# EAGLE schematic ARM-LPC1115_V0.30D_smd (EAGLE 6.5.0)
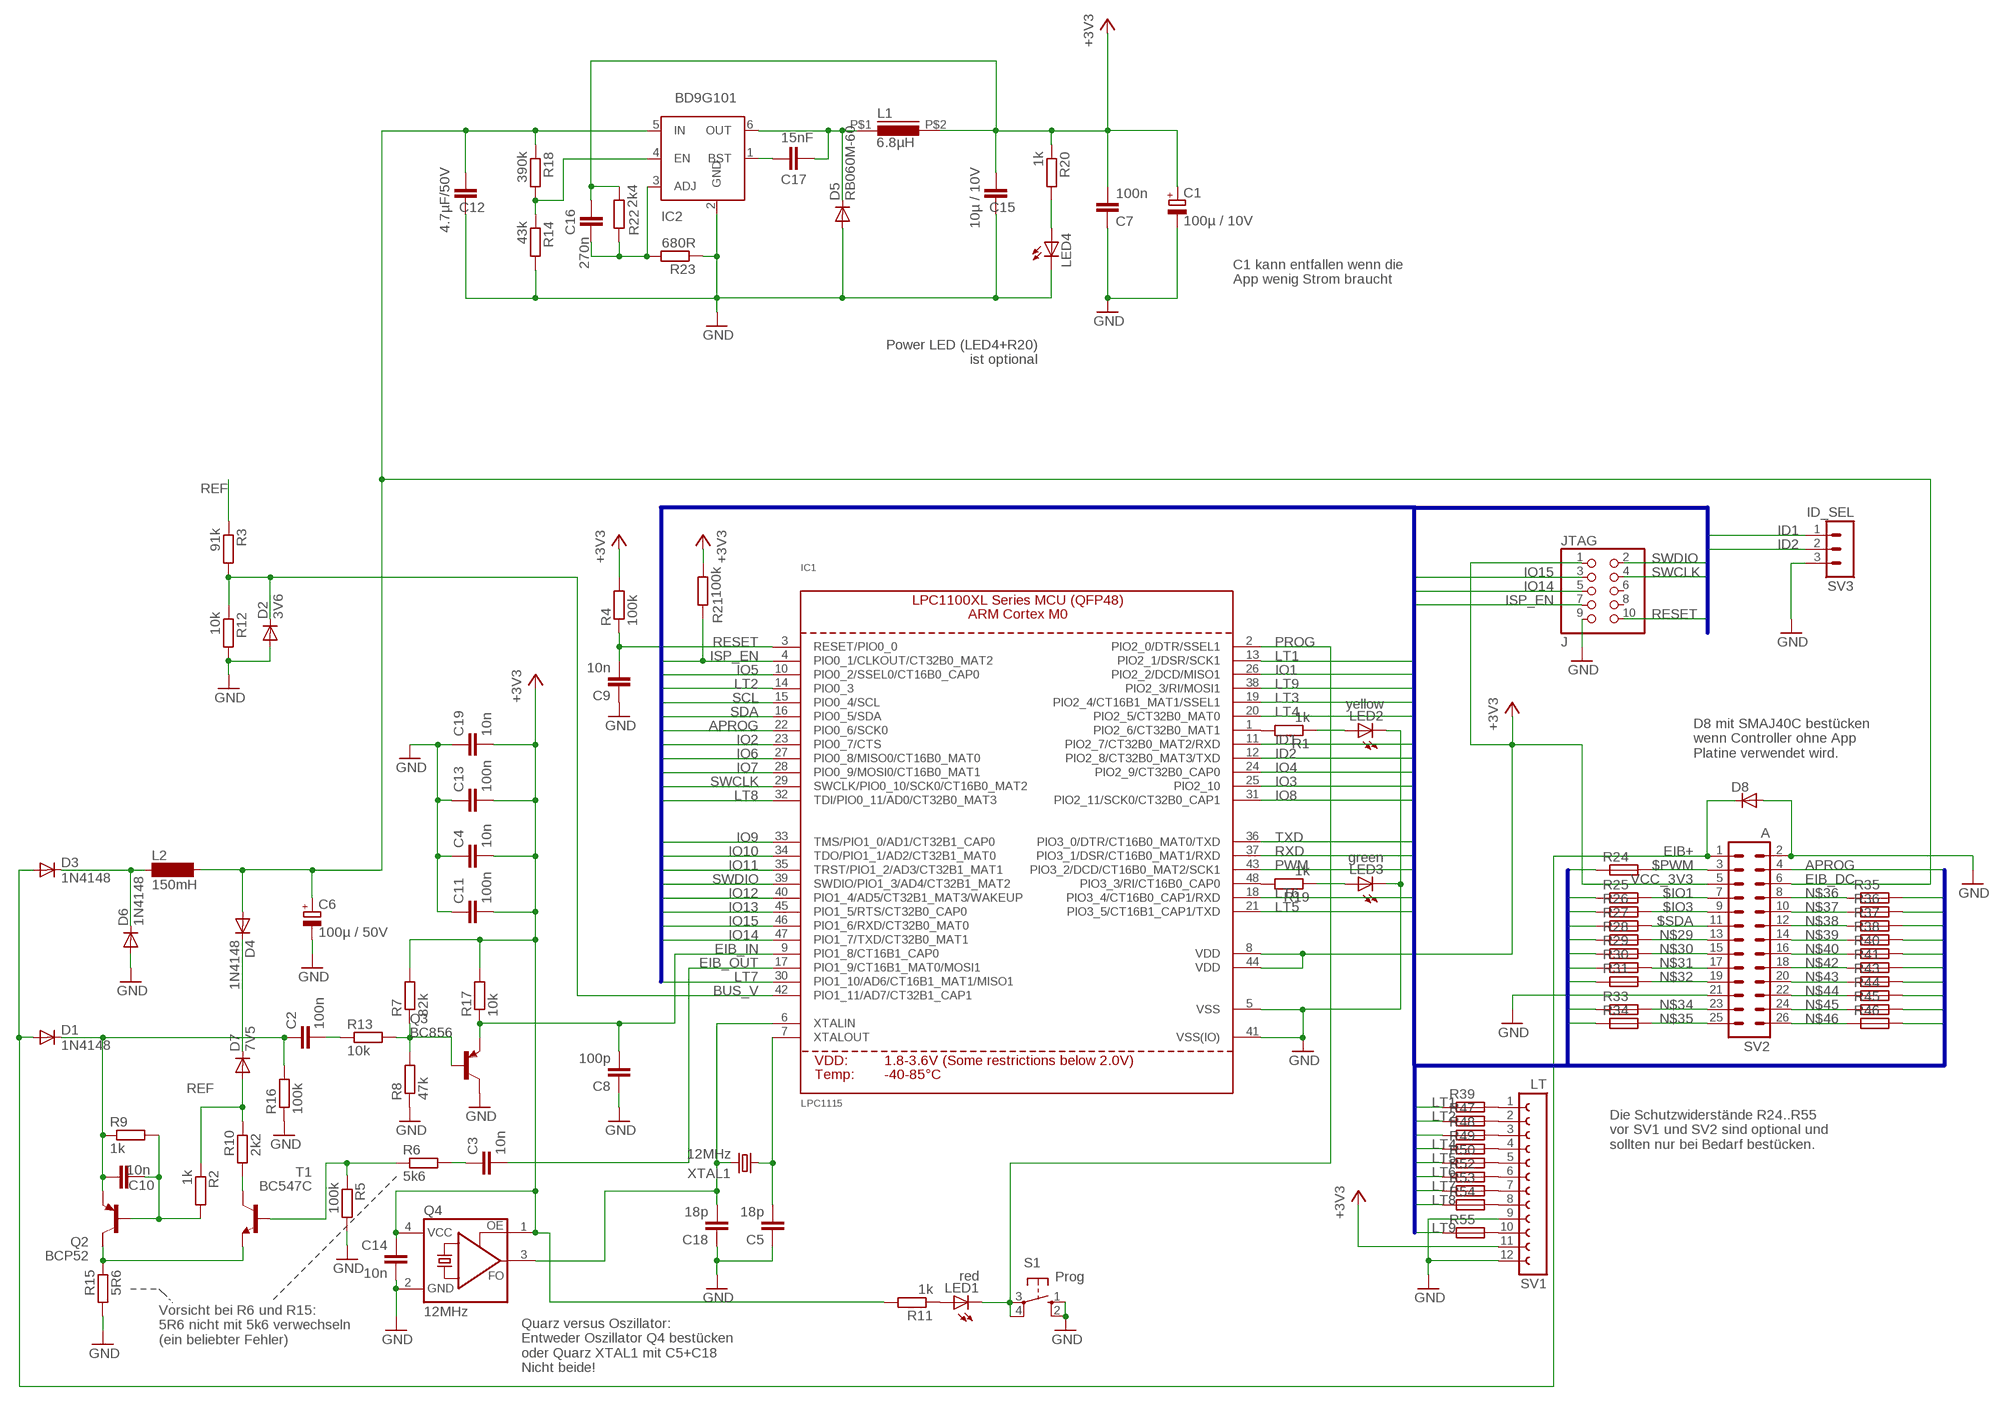
[diagram p0: schematic, sheet 1]

## Parts
C1  100µ / 10V  CPOL-EUE5-8.5  [E5-8,5]
C2  100n  C-EUC1206K  [C1206K]
C3  10n  C-EUC1206K  [C1206K]
C4  10n  C-EUC1206  [C1206]
C5  18p  C-EUC0603  [C0603]
C6  100µ / 50V  CPOL-EUE5-8.5  [E5-8,5]
C7  100n  C-EUC1206  [C1206]
C8  100p  C-EUC1206K  [C1206K]
C9  10n  C-EUC1206K  [C1206K]
C10  10n  C-EUC1206K  [C1206K]
C11  100n  C-EUC1206  [C1206]
C12  4.7µF/50V  C-EUC1206K  [C1206K]
C13  100n  C-EUC1206  [C1206]
C14  10n  C-EUC1206  [C1206]
C15  10µ / 10V  C-EUC1206K  [C1206K]
C16  270n  C-EUC1206  [C1206]
C17  15nF  C-EUC1206  [C1206]
C18  18p  C-EUC0603  [C0603]
C19  10n  C-EUC1206  [C1206]
D1  1N4148  DIODE-MINIMELF  [MINIMELF]
D2  3V6  DIODE-MINIMELF  [MINIMELF]
D3  1N4148  DIODE-MINIMELF  [MINIMELF]
D4  1N4148  DIODE-MINIMELF  [MINIMELF]
D5  RB060M-60  DIODE-SOD123  [SOD123]
D6  1N4148  DIODE-MINIMELF  [MINIMELF]
D7  7V5  DIODE-MINIMELF  [MINIMELF]
D8  D-SMB  [SMB]
IC1  LPC1115  LPC1113/4/5_QFP48_XLSERIES  [LQFP48]
IC2  BD9G101  BD9G101GBD9G101G-SOT23-6  [SOT23-6]
JTAG  J  PINHD-2X05_2.00  [2X05M]
L1  6.8µH  IND_FASTRON_1616FPS  [PIS2812]
L2  150mH  SD12-1000  [SD12_1000]
LED1  red  LED3MM  [LED3MM]
LED2  yellow  LEDSMT1206  [1206]
LED3  green  LEDSMT1206  [1206]
LED4  LEDSMT1206  [1206]
Q2  BCP52  FZT753SMD  [SOT223]
Q3  BC856  BC856BSMD  [SOT23-BEC]
Q4  12MHz  ASFL  [ASF]
R1  1k  R-EU_R1206  [R1206]
R2  1k  R-EU_R1206  [R1206]
R3  91k  R-EU_R1206  [R1206]
R4  100k  R-EU_R1206  [R1206]
R5  100k  R-EU_R1206  [R1206]
R6  5k6  R-EU_R1206  [R1206]
R7  82k  R-EU_R1206  [R1206]
R8  47k  R-EU_R1206  [R1206]
R9  1k  R-EU_R1206  [R1206]
R10  2k2  R-EU_R1206  [R1206]
R11  1k  R-EU_R1206  [R1206]
R12  10k  R-EU_R1206  [R1206]
R13  10k  R-EU_R1206  [R1206]
R14  43k  R-EU_R1206  [R1206]
R15  5R6  R-EU_R1206  [R1206]
R16  100k  R-EU_R1206  [R1206]
R17  10k  R-EU_R1206  [R1206]
R18  390k  R-EU_R1206  [R1206]
R19  1k  R-EU_R1206  [R1206]
R20  1k  R-EU_R1206  [R1206]
R21  100k  R-EU_R1206  [R1206]
R22  2k4  R-EU_R1206  [R1206]
R23  680R  R-EU_R1206  [R1206]
R24  R-EU_BRIDGER0603  [R0603_BRIDGE]
R25  R-EU_BRIDGER0603  [R0603_BRIDGE]
R26  R-EU_BRIDGER0603  [R0603_BRIDGE]
R27  R-EU_BRIDGER0603  [R0603_BRIDGE]
R28  R-EU_BRIDGER0603  [R0603_BRIDGE]
R29  R-EU_BRIDGER0603  [R0603_BRIDGE]
R30  R-EU_BRIDGER0603  [R0603_BRIDGE]
R31  R-EU_BRIDGER0603  [R0603_BRIDGE]
R33  R-EU_BRIDGER0603  [R0603_BRIDGE]
R34  R-EU_BRIDGER0603  [R0603_BRIDGE]
R35  R-EU_BRIDGER0603  [R0603_BRIDGE]
R36  R-EU_BRIDGER0603  [R0603_BRIDGE]
R37  R-EU_BRIDGER0603  [R0603_BRIDGE]
R38  R-EU_BRIDGER0603  [R0603_BRIDGE]
R39  R-EU_BRIDGER0603  [R0603_BRIDGE]
R40  R-EU_BRIDGER0603  [R0603_BRIDGE]
R41  R-EU_BRIDGER0603  [R0603_BRIDGE]
R43  R-EU_BRIDGER0603  [R0603_BRIDGE]
R44  R-EU_BRIDGER0603  [R0603_BRIDGE]
R45  R-EU_BRIDGER0603  [R0603_BRIDGE]
R46  R-EU_BRIDGER0603  [R0603_BRIDGE]
R47  R-EU_BRIDGER0603  [R0603_BRIDGE]
R48  R-EU_BRIDGER0603  [R0603_BRIDGE]
R49  R-EU_BRIDGER0603  [R0603_BRIDGE]
R50  R-EU_BRIDGER0603  [R0603_BRIDGE]
R52  R-EU_BRIDGER0603  [R0603_BRIDGE]
R53  R-EU_BRIDGER0603  [R0603_BRIDGE]
R54  R-EU_BRIDGER0603  [R0603_BRIDGE]
R55  R-EU_BRIDGER0603  [R0603_BRIDGE]
S1  Prog  10-XX  [B3F-10XX]
SV1  LT  FE12-1  [FE12]
SV2  A  ML26  [ML26]
SV3  ID_SEL  MA03-1  [MA03-1]
T1  BC547C  BC847  [SOT23]
XTAL1  12MHz  CRYSTALHC49S  [HC49/S]

## Nets
$IO1: R25.2 SV2.7
$IO3: R26.2 SV2.9
$PWM: R24.2 SV2.3
$SDA: R27.2 SV2.11
APROG: IC1.22(PIO0_6/SCK0) SV2.4
BUS_V: D2.C IC1.42(PIO1_11/AD7/CT32B1_CAP1) R3.2 R12.1
DRAIN: C2.1 C10.1 D1.C Q2.3(E) R9.1 R16.2
EIB+: D1.A D3.A D8.1(C) SV2.1
EIB_DC: C6.+ C12.2 D4.A IC2.5(IN) L2.2 R18.1 SV2.6
EIB_IN: C8.2 IC1.9(PIO1_8/CT16B1_CAP0) Q3.E R17.1
EIB_OUT: C3.2 IC1.17(PIO1_9/CT16B1_MAT0/MOSI1)
GND: C1.- C4.1 C5.1 C6.- C7.1 C8.1 C9.1 C11.1 C12.1 C13.1 C14.2 C15.1 C18.1 C19.1 D2.A D5.A D6.A D8.2(A) IC1.5(VSS) IC1.41(VSS(IO)) IC2.2(GND) JTAG.9 LED2.C LED3.C LED4.C Q3.C Q4.2(GND) R5.2 R8.1 R12.2 R14.2 R15.1 R16.1 R23.1 S1.1(S) S1.2(S1) SV1.9 SV1.12 SV2.2 SV2.21 SV3.3
ID1: IC1.11(PIO2_7/CT32B0_MAT2/RXD) SV3.1
ID2: IC1.12(PIO2_8/CT32B0_MAT3/TXD) SV3.2
IO1: IC1.26(PIO2_2/DCD/MISO1) R25.1
IO2: IC1.23(PIO0_7/CTS) R35.2
IO3: IC1.25(PIO2_10) R26.1
IO4: IC1.24(PIO2_9/CT32B0_CAP0) R36.2
IO5: IC1.10(PIO0_2/SSEL0/CT16B0_CAP0) R28.1
IO6: IC1.27(PIO0_8/MISO0/CT16B0_MAT0) R38.2
IO7: IC1.28(PIO0_9/MOSI0/CT16B0_MAT1) R29.1
IO8: IC1.31(PIO2_11/SCK0/CT32B0_CAP1) R40.2
IO9: IC1.33(TMS/PIO1_0/AD1/CT32B1_CAP0) R31.1
IO10: IC1.34(TDO/PIO1_1/AD2/CT32B1_MAT0) R43.2
IO11: IC1.35(TRST/PIO1_2/AD3/CT32B1_MAT1) R44.2
IO12: IC1.40(PIO1_4/AD5/CT32B1_MAT3/WAKEUP) R33.1
IO13: IC1.45(PIO1_5/RTS/CT32B0_CAP0) R45.2
IO14: IC1.47(PIO1_7/TXD/CT32B0_MAT1) JTAG.5 R34.1
IO15: IC1.46(PIO1_6/RXD/CT32B0_MAT0) JTAG.3 R46.2
ISP_EN: IC1.4(PIO0_1/CLKOUT/CT32B0_MAT2) JTAG.7 R21.1
LT1: IC1.13(PIO2_1/DSR/SCK1) R39.1
LT2: IC1.14(PIO0_3) R47.1
LT3: IC1.19(PIO2_4/CT16B1_MAT1/SSEL1) R48.1
LT4: IC1.20(PIO2_5/CT32B0_MAT0) R49.1
LT5: IC1.21(PIO3_5/CT16B1_CAP1/TXD) R50.1
LT6: IC1.18(PIO3_4/CT16B0_CAP1/RXD) R52.1
LT7: IC1.30(PIO1_10/AD6/CT16B1_MAT1/MISO1) R53.1
LT8: IC1.32(TDI/PIO0_11/AD0/CT32B0_MAT3) R54.1
LT9: IC1.38(PIO2_3/RI/MOSI1) R55.1
LX: C17.1 D5.C IC2.6(OUT) L1.P$1
N$1: C3.1 R6.2
N$2: C2.2 R13.1
N$3: C5.2 IC1.7(XTALOUT) XTAL1.1
N$4: IC1.1(PIO2_6/CT32B0_MAT1) R1.2
N$5: IC1.48(PIO3_3/RI/CT16B0_CAP0) R19.2
N$6: R10.1 T1.3(C)
N$7: Q2.2(C) R15.2 T1.2(E)
N$8: D3.C D6.C L2.1
N$9: D4.C D7.C
N$10: LED2.A R1.1
N$11: LED3.A R19.1
N$12: R5.1 R6.1 T1.1(B)
N$13: LED4.A R20.2
N$14: Q3.B R7.1 R8.2 R13.2
N$15: C10.2 Q2.1(B) R2.2 R9.2
N$17: C18.2 IC1.6(XTALIN) Q4.3(FO) XTAL1.2
N$19: C17.2 IC2.1(BST)
N$20: IC2.4(EN) R14.1 R18.2
N$24: C16.1 IC2.3(ADJ) R22.1 R23.2
N$29: R28.2 SV2.13
N$30: R29.2 SV2.15
N$31: R30.2 SV2.17
N$32: R31.2 SV2.19
N$34: R33.2 SV2.23
N$35: R34.2 SV2.25
N$36: R35.1 SV2.8
N$37: R36.1 SV2.10
N$38: R37.1 SV2.12
N$39: R38.1 SV2.14
N$40: R40.1 SV2.16
N$41: LED1.A R11.1
N$42: R41.1 SV2.18
N$43: R43.1 SV2.20
N$44: R44.1 SV2.22
N$45: R45.1 SV2.24
N$46: R46.1 SV2.26
N$47: R39.2 SV1.1
N$48: R47.2 SV1.2
N$49: R48.2 SV1.3
N$50: R49.2 SV1.4
N$51: R50.2 SV1.5
N$52: R52.2 SV1.6
N$53: R53.2 SV1.7
N$54: R54.2 SV1.8
N$55: R55.2 SV1.10
PROG: IC1.2(PIO2_0/DTR/SSEL1) LED1.K(C) S1.3(P) S1.4(P1)
PWM: IC1.43(PIO3_2/DCD/CT16B0_MAT2/SCK1) R24.1
REF: D7.A R2.1 R3.1 R10.2
RESET: C9.2 IC1.3(RESET/PIO0_0) JTAG.10 R4.1
RXD: IC1.37(PIO3_1/DSR/CT16B0_MAT1/RXD) R41.2
SCL: IC1.15(PIO0_4/SCL) R37.2
SDA: IC1.16(PIO0_5/SDA) R27.1
SWCLK: IC1.29(SWCLK/PIO0_10/SCK0/CT16B0_MAT2) JTAG.4
SWDIO: IC1.39(SWDIO/PIO1_3/AD4/CT32B1_MAT2) JTAG.2
TXD: IC1.36(PIO3_0/DTR/CT16B0_MAT0/TXD) R30.1
VCC_3V3: C1.+ C4.2 C7.2 C11.2 C13.2 C14.1 C15.2 C16.2 C19.2 IC1.8(VDD) IC1.44(VDD) JTAG.1 L1.P$2 Q4.1(OE) Q4.4(VCC) R4.2 R7.2 R11.2 R17.2 R20.1 R21.2 R22.2 SV1.11 SV2.5 ; supply symbol labelled +3V3
Unconnected: JTAG.6 JTAG.8 Q2.4(C/)

## Buses
IO[1..15],LT[1..9],SCL,SDA,PWM,APROG,RXD,TXD,RESET,SWCLK,SWDIO,ISP_EN,ID1,ID2

## Notes on the sheet
- C1 kann entfallen wenn die
  App wenig Strom braucht
- Power LED (LED4+R20)
  ist optional
- D8 mit SMAJ40C bestücken
  wenn Controller ohne App
  Platine verwendet wird.
- Die Schutzwiderstände R24..R55
  vor SV1 und SV2 sind optional und
  sollten nur bei Bedarf bestücken.
- Vorsicht bei R6 und R15:
  5R6 nicht mit 5k6 verwechseln
  (ein beliebter Fehler)
- Quarz versus Oszillator:
  Entweder Oszillator Q4 bestücken
  oder Quarz XTAL1 mit C5+C18
  Nicht beide!

## Library data of the parts
C1 C6 = rcl:CPOL-EU: POLARIZED CAPACITOR, European symbol
C2-C5 C7-C19 = rcl:C-EU: CAPACITOR, European symbol
D1-D7 = diode:DIODE-: DIODE
D8 = semicon-smd-ipc:D-: DIODE unfilled
IC1 = microbuilder:LPC1113/4/5_QFP48_XLSERIES: LPC1113/4/5 ARM Cortex M0 MCU (50MHz) - XL Series (FBD48/3x3) LPC1115FBD48/303: Max Frequency: 50MHz Flash: 64kB SRAM: 8kB ADC: 10-bit
IC2 = Stefan_selfbus:BD9G101G
JTAG = pinhead-2:PINHD-2X05: PIN HEADER
L1 = Stefan_selfbus:IND_FASTRON_1616FPS
L2 = inductor-neosid:SD12: INDUCTOR nominal inductance
LED1-LED4 = led:LED: LED OSRAM: - CHIPLED LG R971, LG N971, LY N971, LG Q971, LY Q971, LO R971, LY R971 LH N974, LH R974 LS Q976, LO Q976, LY Q976 LO Q996 - Hyper CHIPLED LW Q18S LB Q993, LB Q99A, LB R99A - SideLED LS A670, LO A670, LY A670, LG A670, LP A670 LB A673, LV A673, LT A673, LW A673 LH A674 LY A675 LS A676, LA A676, LO A676, LY A676, LW A676 LS A679, LY A679, LG A679 - Hyper Micro SIDELED® LS Y876, LA Y876, LO Y876, LY Y876 LT Y87S - SmartLED LW L88C, LW L88S LB L89C, LB L89S, LG L890 LS L89K, LO L89K, LY L89K LS L896, LA L896, LO L896, LY L896 - TOPLED LS T670, LO T670, LY T670, LG T670, LP T670 LSG T670, LSP T670, LSY T670, LOP T670, LYG T670 LG T671, LOG T671, LSG T671 LB T673, LV T673, LT T673, LW T673 LH T674 LS T676, LA T676, LO T676, LY T676, LB T676, LH T676, LSB T676, LW T676 LB T67C, LV T67C, LT T67C, LS T67K, LO T67K, LY T67K, LW E67C LS E67B, LA E67B, LO E67B, LY E67B, LB E67C, LV E67C, LT E67C LW T67C LS T679, LY T679, LG T679 LS T770, LO T770, LY T770, LG T770, LP T770 LB T773, LV T773, LT T773, LW T773 LH T774 LS E675, LA E675, LY E675, LS T675 LS T776, LA T776, LO T776, LY T776, LB T776 LHGB T686 LT T68C, LB T68C - Hyper Mini TOPLED® LB M676 - Mini TOPLED Santana® LG M470 LS M47K, LO M47K, LY M47K Source: http://www.osram.convergy.de - LUMILED® LXK2-PW12-R00, LXK2-PW12-S00, LXK2-PW14-U00, LXK2-PW14-V00 LXK2-PM12-R00, LXK2-PM12-S00, LXK2-PM14-U00 LXK2-PE12-Q00, LXK2-PE12-R00, LXK2-PE12-S00, LXK2-PE14-T00, LXK2-PE14-U00 LXK2-PB12-K00, LXK2-PB12-L00, LXK2-PB12-M00, LXK2-PB14-N00, LXK2-PB14-P00, LXK2-PB14-Q00 LXK2-PR12-L00, LXK2-PR12-M00, LXK2-PR14-Q00, LXK2-PR14-R00 LXK2-PD12-Q00, LXK2-PD12-R00, LXK2-PD12-S00 LXK2-PH12-R00, LXK2-PH12-S00 LXK2-PL12-P00, LXK2-PL12-Q00, LXK2-PL12-R00 Source: www.luxeon.com
Q2 = transistor-pnp:FZT753SMD: PNP Transistor
Q3 = transistor-pnp:BC856*: PNP Transistror
Q4 = crystal:ASF*: CRYSTAL CLOCK OSCILLATORS 5.0 Vdc or 3.3 Vdc - LOW PROFILE ULTRA MINIATURE CERAMIC SURFACE MOUNT Source: http://www.abracon.com/Oscillators/asf1-L-L1.pdf
R1-R23 = rcl:R-EU_: RESISTOR, European symbol
R24-R31 R33-R41 R43-R50 R52-R55 = Stefan_selfbus:R-EU_BRIDGE: RESISTOR, European symbol
S1 = switch-omron:10-XX: OMRON SWITCH
SV1 = con-lsta:FE12-1: FEMALE HEADER; OC_FARNELL: unknown; OC_NEWARK: unknown
SV2 = con-harting-ml:ML26: HARTING; OC_FARNELL: unknown; OC_NEWARK: unknown
SV3 = con-lstb:MA03-1: PIN HEADER; OC_FARNELL: unknown; OC_NEWARK: unknown
T1 = transistor:BC847: NPN TRANSISTOR
XTAL1 = crystal:CRYSTAL: CRYSTAL